# EAGLE design led-flex-board (EAGLE 8.3.2)
DESIGNER: Jon Newman, Galen Lynch; DESING_NAME: LED FLEX BOARD; LICENSE: CERN OHL v1.2; REVISION: 1.0
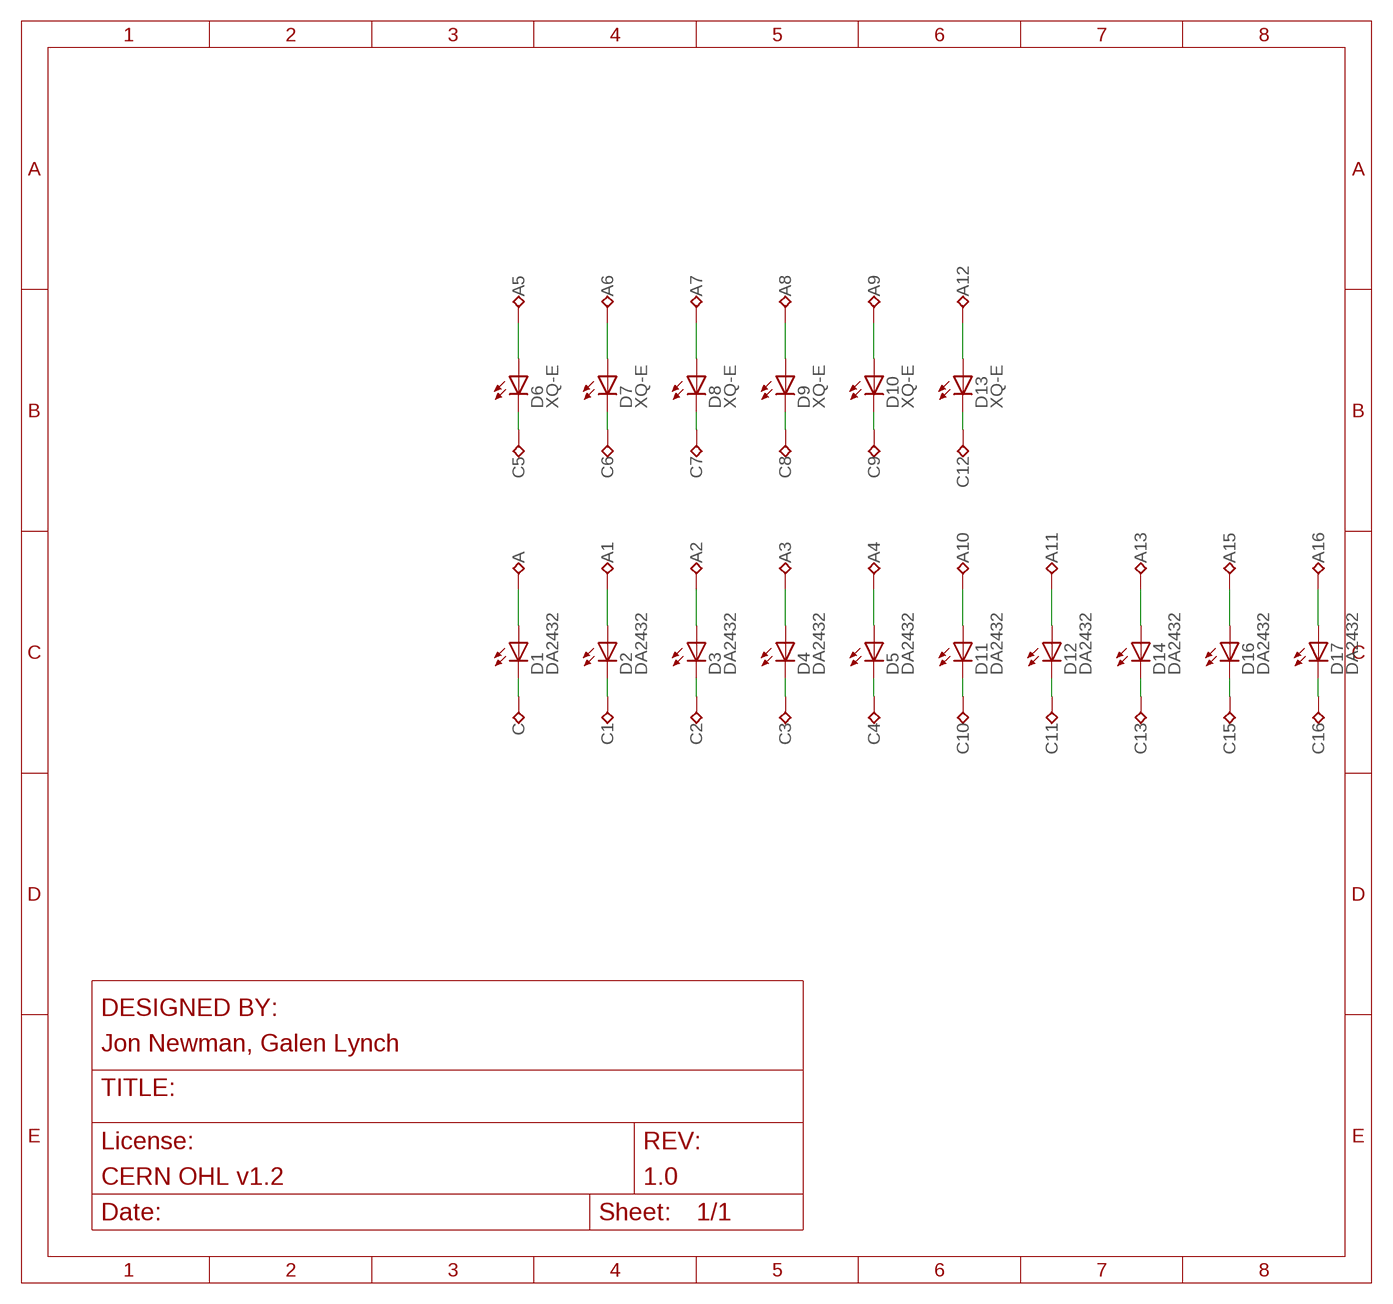
[diagram p0: schematic, sheet 1]

## Parts
A  TP_S0.6X1.5MM  [S0.6X1.5MM]
A1  TP_S0.6X1.5MM  [S0.6X1.5MM]
A2  TP_S0.6X1.5MM  [S0.6X1.5MM]
A3  TP_S0.6X1.5MM  [S0.6X1.5MM]
A4  TP_S0.6X1.5MM  [S0.6X1.5MM]
A5  TP_S0.6X1.5MM  [S0.6X1.5MM]
A6  TP_S0.6X1.5MM  [S0.6X1.5MM]
A7  TP_S0.6X1.5MM  [S0.6X1.5MM]
A8  TP_S0.6X1.5MM  [S0.6X1.5MM]
A9  TP_S0.6X1.5MM  [S0.6X1.5MM]
A10  TP_S0.6X1.5MM  [S0.6X1.5MM]
A11  TP_S0.6X1.5MM  [S0.6X1.5MM]
A12  TP_S0.6X1.5MM  [S0.6X1.5MM]
A13  TP_S0.6X1.5MM  [S0.6X1.5MM]
A15  TP_S0.6X1.5MM  [S0.6X1.5MM]
A16  TP_S0.6X1.5MM  [S0.6X1.5MM]
C  TP_S0.6X1.5MM  [S0.6X1.5MM]
C1  TP_S0.6X1.5MM  [S0.6X1.5MM]
C2  TP_S0.6X1.5MM  [S0.6X1.5MM]
C3  TP_S0.6X1.5MM  [S0.6X1.5MM]
C4  TP_S0.6X1.5MM  [S0.6X1.5MM]
C5  TP_S0.6X1.5MM  [S0.6X1.5MM]
C6  TP_S0.6X1.5MM  [S0.6X1.5MM]
C7  TP_S0.6X1.5MM  [S0.6X1.5MM]
C8  TP_S0.6X1.5MM  [S0.6X1.5MM]
C9  TP_S0.6X1.5MM  [S0.6X1.5MM]
C10  TP_S0.6X1.5MM  [S0.6X1.5MM]
C11  TP_S0.6X1.5MM  [S0.6X1.5MM]
C12  TP_S0.6X1.5MM  [S0.6X1.5MM]
C13  TP_S0.6X1.5MM  [S0.6X1.5MM]
C15  TP_S0.6X1.5MM  [S0.6X1.5MM]
C16  TP_S0.6X1.5MM  [S0.6X1.5MM]
D1  DA2432  LED_DA2432  [DA2432]
D2  DA2432  LED_DA2432  [DA2432]
D3  DA2432  LED_DA2432  [DA2432]
D4  DA2432  LED_DA2432  [DA2432]
D5  DA2432  LED_DA2432  [DA2432]
D6  XQ-E  LED_XLAMP1.6X1.6MM  [XLAMP_1.6X1.6MM]
D7  XQ-E  LED_XLAMP1.6X1.6MM  [XLAMP_1.6X1.6MM]
D8  XQ-E  LED_XLAMP1.6X1.6MM  [XLAMP_1.6X1.6MM]
D9  XQ-E  LED_XLAMP1.6X1.6MM  [XLAMP_1.6X1.6MM]
D10  XQ-E  LED_XLAMP1.6X1.6MM  [XLAMP_1.6X1.6MM]
D11  DA2432  LED_DA2432  [DA2432]
D12  DA2432  LED_DA2432  [DA2432]
D13  XQ-E  LED_XLAMP1.6X1.6MM  [XLAMP_1.6X1.6MM]
D14  DA2432  LED_DA2432  [DA2432]
D16  DA2432  LED_DA2432  [DA2432]
D17  DA2432  LED_DA2432  [DA2432]

## Nets
N$1: C.TP D1.C
N$2: A.TP D1.A
N$3: C1.TP D2.C
N$4: A1.TP D2.A
N$5: C2.TP D3.C
N$6: A2.TP D3.A
N$7: C3.TP D4.C
N$8: A3.TP D4.A
N$9: C4.TP D5.C
N$10: A4.TP D5.A
N$11: C5.TP D6.C
N$12: A5.TP D6.A
N$13: C6.TP D7.C
N$14: A6.TP D7.A
N$15: C7.TP D8.C
N$16: A7.TP D8.A
N$17: C8.TP D9.C
N$18: A8.TP D9.A
N$19: C9.TP D10.C
N$20: A9.TP D10.A
N$21: C10.TP D11.C
N$22: A10.TP D11.A
N$23: C11.TP D12.C
N$24: A11.TP D12.A
N$25: C12.TP D13.C
N$26: A12.TP D13.A
N$27: C13.TP D14.C
N$28: A13.TP D14.A
N$31: C15.TP D16.C
N$32: A15.TP D16.A
N$33: C16.TP D17.C
N$34: A16.TP D17.A

## Library data of the parts
A A1-A13 A15 A16 C C1-C13 C15 C16 = jonnew:TP: Test pad
D1-D14 D16 D17 = jonnew:LED: Surface mount LED

## Board
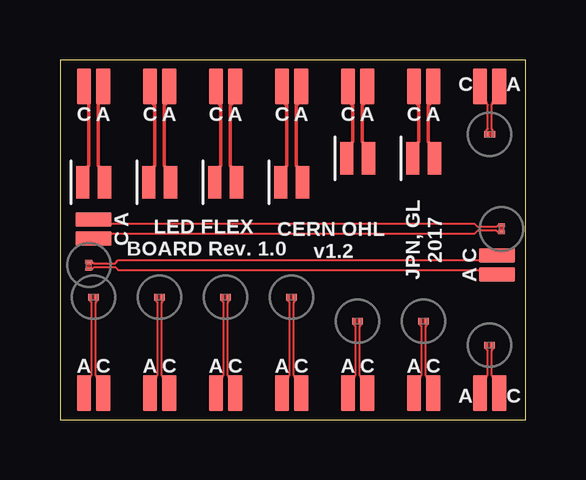
[diagram p1: board, top side]

Size 19.4 x 15 mm. Coordinates in mm from the lower left corner, seen from the top.
Outline: 0,0 19.4,0 19.4,15 0,15 0,0
Copper layers 1: Top 0.036mm
Design rules "speedy-1-layer-flex": minimum track width 2mil, minimum drill 3mil, track to track 3mil, track to pad 3mil, pad to pad 2mil, via to via 3mil, smd to smd 2mil, copper to edge 5mil, drill to drill 5mil, minimum pad ring 2mil, minimum via ring 2mil, stop-mask expansion 1mil, vias tented up to drill 20mil, thermal gap 10mil

### Footprints (pad centres in the part's own frame; a part is rotated, then mirrored left to right if it is on the bottom)
S0.6X1.5MM = smd 0.6 x 1.5: TP 0,0
DA2432 = smd 0.28 x 0.1: A 0,0.175 | smd 0.28 x 0.15: C 0,-0.14
XLAMP_1.6X1.6MM = smd 0.55 x 1.35: A 0.45,0; C -0.45,0

### Placement (x,y rotation side)
A  1,1.1 0 top
A1  3.75,1.1 0 top
A2  6.5,1.1 0 top
A3  9.25,1.1 0 top
A4  12,1.1 0 top
A5  12.8,13.9 180 top
A6  10.05,13.9 180 top
A7  7.3,13.9 180 top
A8  4.55,13.9 180 top
A9  1.8,13.9 180 top
A10  14.75,1.1 0 top
A11  17.5,1.1 0 top
A12  15.55,13.9 180 top
A13  18.3,13.9 180 top
A15  18.2,6.05 90 top
A16  1.4,8.35 270 top
C  1.8,1.1 0 top
C1  4.55,1.1 0 top
C2  7.3,1.1 0 top
C3  10.05,1.1 0 top
C4  12.8,1.1 0 top
C5  12,13.9 180 top
C6  9.25,13.9 180 top
C7  6.5,13.9 180 top
C8  3.75,13.9 180 top
C9  1,13.9 180 top
C10  15.55,1.1 0 top
C11  18.3,1.1 0 top
C12  14.75,13.9 180 top
C13  17.5,13.9 180 top
C15  18.2,6.85 90 top
C16  1.4,7.55 270 top
D1  1.4,5.1 90 top
D2  4.15,5.1 90 top
D3  6.9,5.1 90 top
D4  9.65,5.1 90 top
D5  12.4,4.1 90 top
D6  12.4,10.9 0 top
D7  9.65,9.9 0 top
D8  6.9,9.9 0 top
D9  4.15,9.9 0 top
D10  1.4,9.9 0 top
D11  15.15,4.1 90 top
D12  17.9,3.1 90 top
D13  15.15,10.9 0 top
D14  17.9,11.9 270 top
D16  1.2,6.45 180 top
D17  18.4,7.95 0 top

### Tracks (layer width: path | path; a pad name or v marks a point on that pad's centre or on a via)
N$1
  Top 0.076: D1.C 1.54,4.97 1.47,4.87 1.47,1.88 C.TP
N$2
  Top 0.076: D1.A 1.23,5 1.31,4.88 1.31,1.86 A.TP
N$3
  Top 0.076: D2.C 4.29,4.97 4.22,4.87 4.22,1.88 C1.TP
N$4
  Top 0.076: D2.A 3.98,5 4.06,4.88 4.06,1.86 A1.TP
N$5
  Top 0.076: D3.C 7.04,4.97 6.97,4.87 6.97,1.88 C2.TP
N$6
  Top 0.076: D3.A 6.73,5 6.81,4.88 6.81,1.86 A2.TP
N$7
  Top 0.076: D4.C 9.79,4.97 9.72,4.87 9.72,1.88 C3.TP
N$8
  Top 0.076: D4.A 9.47,5 9.56,4.88 9.56,1.86 A3.TP
N$9
  Top 0.076: D5.C 12.54,3.97 12.47,3.87 12.47,1.88 C4.TP
N$10
  Top 0.076: D5.A 12.22,4 12.31,3.88 12.31,1.86 A4.TP
N$11
  Top 0.15: C5.TP 12,13.3 12.2,13.1 12.2,11.6 12,11.4 12,10.95 arc-90 D6.C
N$12
  Top 0.15: A5.TP 12.8,13.3 12.6,13.1 12.6,11.6 12.8,11.4 12.8,10.95 arc90 D6.A
N$13
  Top 0.15: C6.TP 9.25,13.3 9.45,13.1 9.45,10.6 9.25,10.4 9.25,9.95 arc-90 D7.C
N$14
  Top 0.15: A6.TP 10.05,13.3 9.85,13.1 9.85,10.6 10.05,10.4 10.05,9.95 arc90 D7.A
N$15
  Top 0.15: C7.TP 6.5,13.3 6.7,13.1 6.7,10.6 6.5,10.4 6.5,9.95 arc-90 D8.C
N$16
  Top 0.15: A7.TP 7.3,13.3 7.1,13.1 7.1,10.6 7.3,10.4 7.3,9.95 arc90 D8.A
N$17
  Top 0.15: C8.TP 3.75,13.3 3.95,13.1 3.95,10.6 3.75,10.4 3.75,9.95 arc-90 D9.C
N$18
  Top 0.076: 4.6,10 D9.A
  Top 0.15: A8.TP 4.55,13.3 4.35,13.1 4.35,10.6 4.55,10.4 4.55,10.05 arc90 4.6,10
N$19
  Top 0.15: C9.TP 1,13.4 1.2,13.2 1.2,10.6 1,10.4 1,9.95 arc-90 D10.C
N$20
  Top 0.15: A9.TP 1.8,13.4 1.6,13.2 1.6,10.6 1.8,10.4 1.8,9.95 arc90 D10.A
N$21
  Top 0.076: D11.C 15.29,3.97 15.22,3.87 15.22,1.88 C10.TP
N$22
  Top 0.076: D11.A 14.97,4 15.06,3.88 15.06,1.86 A10.TP
N$23
  Top 0.076: D12.C 18.04,2.97 17.97,2.87 17.97,1.88 C11.TP
N$24
  Top 0.076: D12.A 17.72,3 17.81,2.88 17.81,1.86 A11.TP
N$25
  Top 0.15: C12.TP 14.75,13.3 14.95,13.1 14.95,11.6 14.75,11.4 14.75,10.95 arc-90 D13.C
N$26
  Top 0.15: A12.TP 15.55,13.3 15.35,13.1 15.35,11.6 15.55,11.4 15.55,10.95 arc90 D13.A
N$27
  Top 0.076: D14.C 17.76,12.03 17.83,12.13 17.83,13.12 C13.TP
N$28
  Top 0.076: D14.A 18.07,12.01 17.99,12.12 17.99,13.14 A13.TP
N$31
  Top 0.076: D16.C 1.33,6.59 1.43,6.52 2.3,6.52 2.44,6.66 17.74,6.66 C15.TP
N$32
  Top 0.076: D16.A 1.31,6.28 1.42,6.36 2.3,6.36 2.42,6.24 17.74,6.24 A15.TP
N$33
  Top 0.076: D17.C 18.27,7.81 18.17,7.88 17.4,7.88 17.26,7.75 1.86,7.75 C16.TP
N$34
  Top 0.076: D17.A 18.29,8.12 18.18,8.04 17.4,8.04 17.28,8.16 1.86,8.16 A16.TP

### Text on the board
tPlace: C | A | C | A | C | A | C | A | C | A | C | A | C | A | A | C | LED FLEX / BOARD Rev. 1.0 | CERN OHL / v1.2 | JPN, GL / 2017 | C | A | A | C | A | C | A | C | A | C | A | C | A | C | A | C